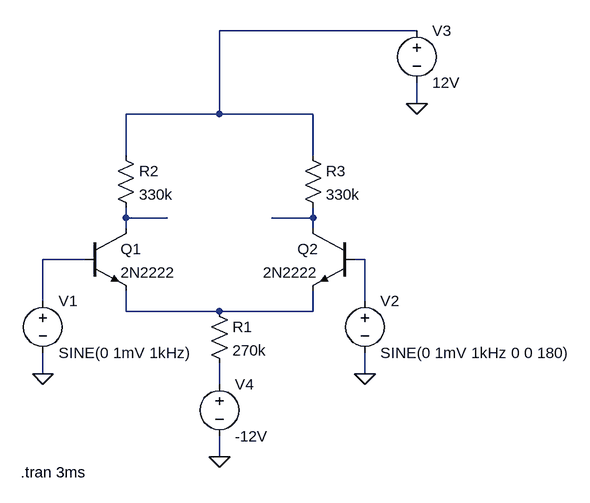
[diagram p0: schematic DifferingAmp.asc]
DifferingAmp.asc, the LTspice schematic file:
Version 4
SHEET 1 880 680
WIRE 608 -256 304 -256
WIRE 608 -144 608 -176
WIRE 304 -128 304 -256
WIRE 304 -128 160 -128
WIRE 448 -128 304 -128
WIRE 160 -64 160 -128
WIRE 448 -64 448 -128
WIRE 160 32 160 16
WIRE 224 32 160 32
WIRE 448 32 448 16
WIRE 448 32 384 32
WIRE 160 48 160 32
WIRE 448 48 448 32
WIRE 96 96 32 96
WIRE 528 96 512 96
WIRE 32 160 32 96
WIRE 528 160 528 96
WIRE 160 176 160 144
WIRE 304 176 160 176
WIRE 448 176 448 144
WIRE 448 176 304 176
WIRE 32 272 32 240
WIRE 528 272 528 240
WIRE 304 288 304 256
WIRE 304 400 304 368
FLAG 32 272 0
FLAG 528 272 0
FLAG 608 -144 0
FLAG 304 400 0
SYMBOL voltage 32 144 R0
WINDOW 123 0 0 Left 0
WINDOW 39 0 0 Left 0
SYMATTR InstName V1
SYMATTR Value SINE(0 1mV 1kHz)
SYMBOL voltage 528 144 R0
WINDOW 123 0 0 Left 0
WINDOW 39 0 0 Left 0
SYMATTR InstName V2
SYMATTR Value SINE(0 1mV 1kHz 0 0 180)
SYMBOL res 288 160 R0
SYMATTR InstName R1
SYMATTR Value 270k
SYMBOL res 144 -80 R0
SYMATTR InstName R2
SYMATTR Value 330k
SYMBOL res 432 -80 R0
SYMATTR InstName R3
SYMATTR Value 330k
SYMBOL npn 96 48 R0
SYMATTR InstName Q1
SYMATTR Value 2N2222
SYMBOL voltage 608 -272 R0
SYMATTR InstName V3
SYMATTR Value 12V
SYMBOL voltage 304 272 R0
SYMATTR InstName V4
SYMATTR Value -12V
SYMBOL npn 512 48 M0
SYMATTR InstName Q2
SYMATTR Value 2N2222
TEXT -2 424 Left 2 !.tran 3ms

The netlist it stands for:
* DifferingAmp.asc
V1 N004 0 SINE(0 1mV 1kHz)
V2 N005 0 SINE(0 1mV 1kHz 0 0 180)
R1 N006 N007 270k
R2 N001 N002 330k
R3 N001 N003 330k
Q1 N002 N004 N006 0 2N2222
V3 N001 0 12V
V4 N007 0 -12V
Q2 N003 N005 N006 0 2N2222
.model NPN NPN
.model PNP PNP
.lib standard.bjt
.tran 3ms
.backanno
.end